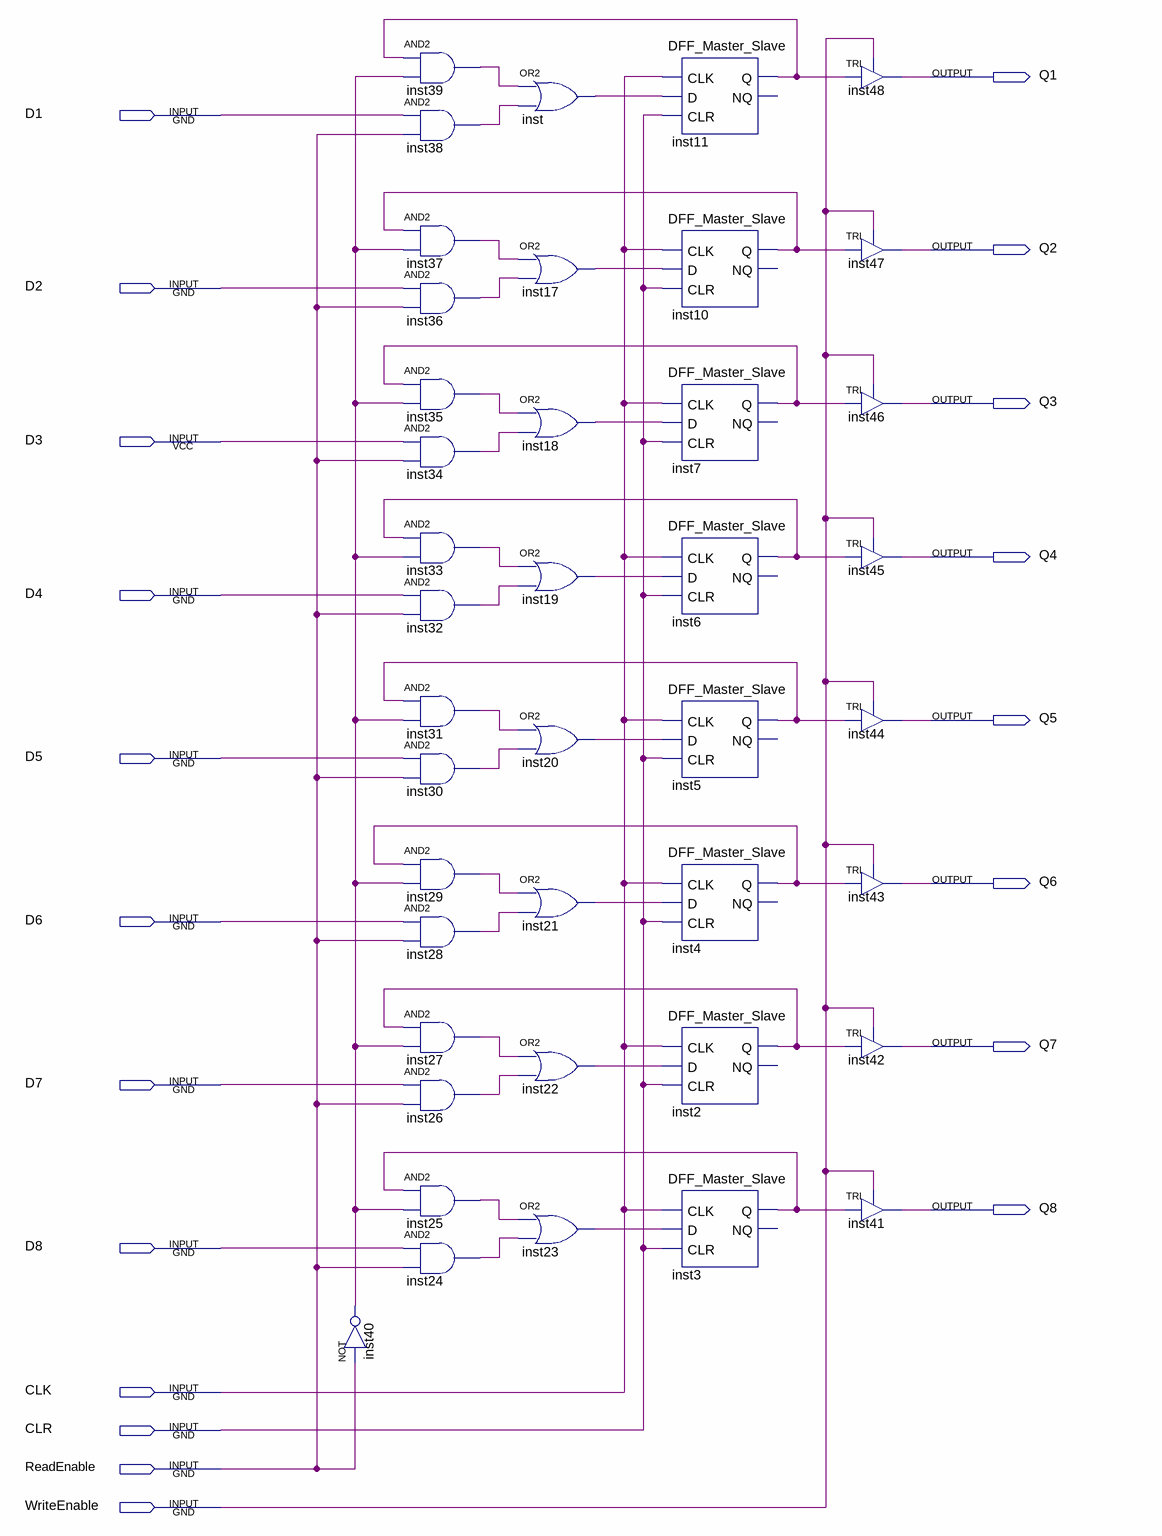
[diagram p0: schematic sheet]
// Quartus schematic Register.bdf as structural Verilog: 41 symbols, 20 pins
module Register (
  input  D1,
  input  D2,
  input  D3,
  input  D4,
  input  D5,
  input  D6,
  input  D7,
  input  D8,
  input  CLK,
  input  CLR,
  input  ReadEnable,
  input  WriteEnable,
  output Q1,
  output Q2,
  output Q3,
  output Q4,
  output Q5,
  output Q6,
  output Q7,
  output Q8
);

  wire inst2_q, inst3_q, inst4_q, inst5_q, inst6_q, inst7_q, inst10_q, inst11_q, inst17_out, inst18_out,
       inst19_out, inst20_out, inst21_out, inst22_out, inst23_out, inst24_out, inst25_out, inst26_out,
       inst27_out, inst28_out, inst29_out, inst30_out, inst31_out, inst32_out, inst33_out, inst34_out,
       inst35_out, inst36_out, inst37_out, inst38_out, inst39_out, inst40_out, inst_out;

  and inst39 (inst39_out, inst11_q, inst40_out);
  and inst38 (inst38_out, D1, ReadEnable);
  and inst37 (inst37_out, inst10_q, inst40_out);
  and inst36 (inst36_out, D2, ReadEnable);
  and inst35 (inst35_out, inst7_q, inst40_out);
  and inst34 (inst34_out, D3, ReadEnable);
  and inst33 (inst33_out, inst6_q, inst40_out);
  and inst32 (inst32_out, D4, ReadEnable);
  and inst31 (inst31_out, inst5_q, inst40_out);
  and inst30 (inst30_out, D5, ReadEnable);
  and inst29 (inst29_out, inst4_q, inst40_out);
  and inst28 (inst28_out, D6, ReadEnable);
  and inst27 (inst27_out, inst2_q, inst40_out);
  and inst26 (inst26_out, D7, ReadEnable);
  and inst25 (inst25_out, inst3_q, inst40_out);
  and inst24 (inst24_out, D8, ReadEnable);
  not inst40 (inst40_out, ReadEnable);
  or inst (inst_out, inst39_out, inst38_out);
  or inst17 (inst17_out, inst37_out, inst36_out);
  or inst18 (inst18_out, inst35_out, inst34_out);
  or inst19 (inst19_out, inst33_out, inst32_out);
  or inst20 (inst20_out, inst31_out, inst30_out);
  or inst21 (inst21_out, inst29_out, inst28_out);
  or inst22 (inst22_out, inst27_out, inst26_out);
  or inst23 (inst23_out, inst25_out, inst24_out);
  DFF_Master_Slave inst11 (.CLK(CLK), .D(inst_out), .CLR(CLR), .Q(inst11_q));  // open: NQ
  DFF_Master_Slave inst10 (.CLK(CLK), .D(inst17_out), .CLR(CLR), .Q(inst10_q));  // open: NQ
  DFF_Master_Slave inst7 (.CLK(CLK), .D(inst18_out), .CLR(CLR), .Q(inst7_q));  // open: NQ
  DFF_Master_Slave inst6 (.CLK(CLK), .D(inst19_out), .CLR(CLR), .Q(inst6_q));  // open: NQ
  DFF_Master_Slave inst5 (.CLK(CLK), .D(inst20_out), .CLR(CLR), .Q(inst5_q));  // open: NQ
  DFF_Master_Slave inst4 (.CLK(CLK), .D(inst21_out), .CLR(CLR), .Q(inst4_q));  // open: NQ
  DFF_Master_Slave inst2 (.CLK(CLK), .D(inst22_out), .CLR(CLR), .Q(inst2_q));  // open: NQ
  DFF_Master_Slave inst3 (.CLK(CLK), .D(inst23_out), .CLR(CLR), .Q(inst3_q));  // open: NQ
  TRI inst48 (.IN(inst11_q), .OE(WriteEnable), .OUT(Q1));
  TRI inst47 (.IN(inst10_q), .OE(WriteEnable), .OUT(Q2));
  TRI inst46 (.IN(inst7_q), .OE(WriteEnable), .OUT(Q3));
  TRI inst45 (.IN(inst6_q), .OE(WriteEnable), .OUT(Q4));
  TRI inst44 (.IN(inst5_q), .OE(WriteEnable), .OUT(Q5));
  TRI inst43 (.IN(inst4_q), .OE(WriteEnable), .OUT(Q6));
  TRI inst42 (.IN(inst2_q), .OE(WriteEnable), .OUT(Q7));
  TRI inst41 (.IN(inst3_q), .OE(WriteEnable), .OUT(Q8));
endmodule
